# Altium schematic sheet Signal Turn D 41mm.SchDoc
size A4
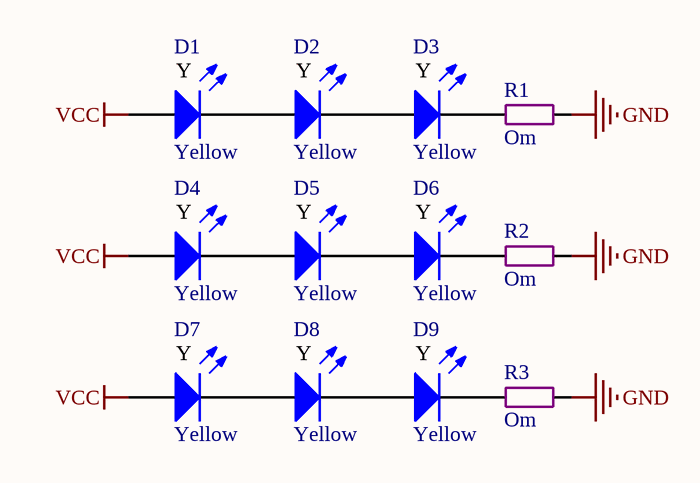
[diagram p0: Signal Turn D 41mm.SchDoc]

## Parts
D1  Yellow  [LED Round 8mm Yellow]
D2  Yellow  [LED Round 8mm Yellow]
D3  Yellow  [LED Round 8mm Yellow]
D4  Yellow  [LED Round 8mm Yellow]
D5  Yellow  [LED Round 8mm Yellow]
D6  Yellow  [LED Round 8mm Yellow]
D7  Yellow  [LED Round 8mm Yellow]
D8  Yellow  [LED Round 8mm Yellow]
D9  Yellow  [LED Round 8mm Yellow]
R1  Om  [Res p20.32 (9p) 2w]
R2  Om  [Res p20.32 (9p) 2w]
R3  Om  [Res p20.32 (9p) 2w]

## Nets
GND: R1.2 R2.2 R3.2
VCC: D1.A D4.A D7.A
NetD1_K: D1.K D2.A
NetD2_K: D2.K D3.A
NetD3_K: D3.K R1.1
NetD4_K: D4.K D5.A
NetD5_K: D5.K D6.A
NetD6_K: D6.K R2.1
NetD7_K: D7.K D8.A
NetD8_K: D8.K D9.A
NetD9_K: D9.K R3.1

## Notes on the sheet
- (in symbol Led Round 8mm Yellow 0.5W) Y

## Library data of the parts
D1-D9 = Led Round 8mm Yellow 0.5W: 2.8-3v 25mA, 4-5cd; Forward Voltage Min: 2.8; Forward Voltage TYP: 3; Wave len min/typ: 580/590; Liminous Min (mcd): 4000; Liminous Typ (mcd): 5000; Forward Amp (mA): 25; Color: Yellow
R1-R3 = Res 2W: 5W Cement